# EAGLE schematic Draft Volt Meter Schematic (EAGLE 9.6.2)
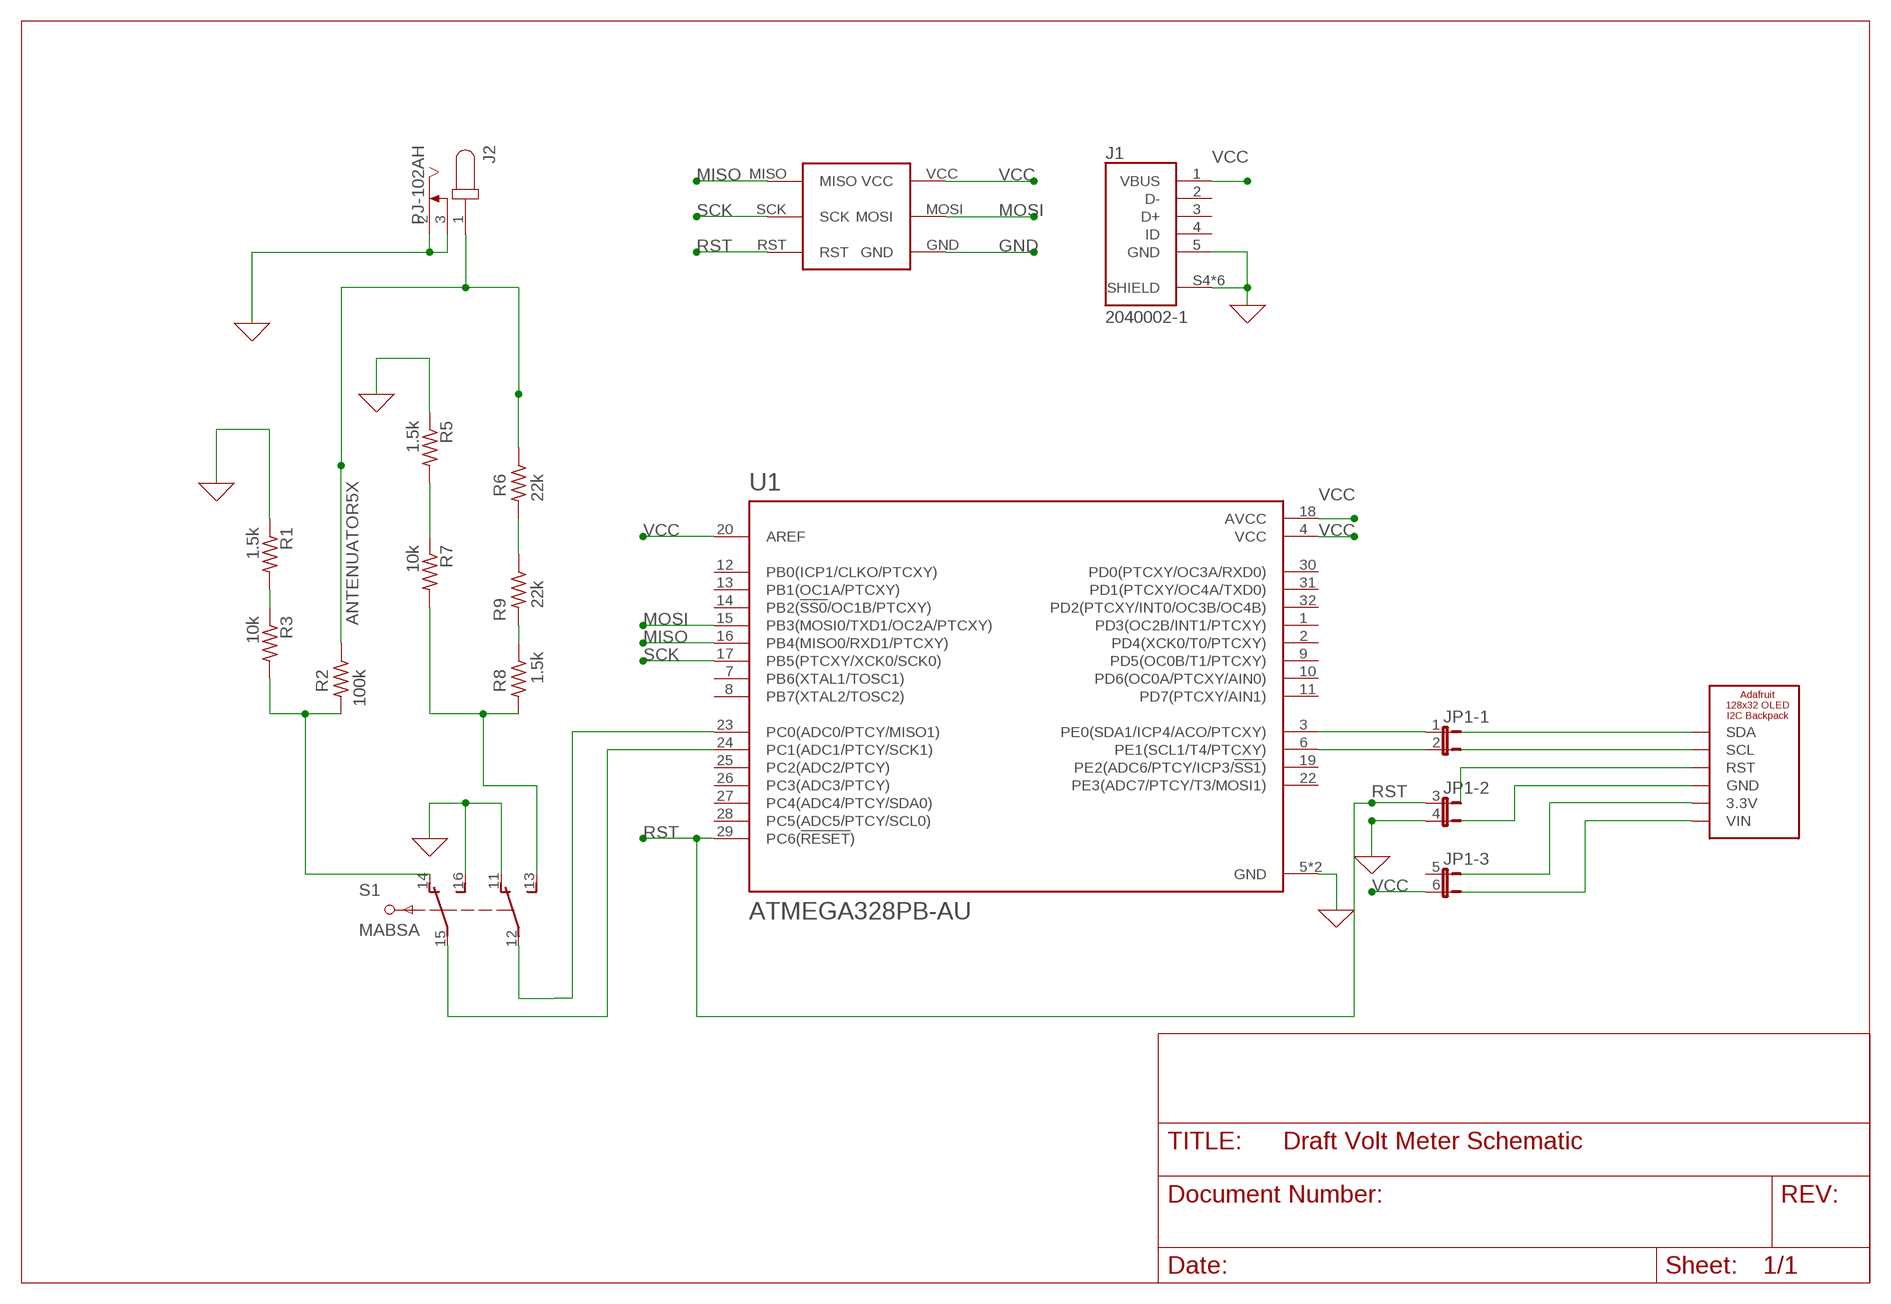
[diagram p0: schematic, sheet 1]

## Parts
J1  2040002-1  [TE_2040002-1]
J2  PJ-102AH  [CUI_PJ-102AH]
JP1  JP3QE  [JP3Q]
R1  1.5k  R-US_0411/15  [0411/15]
R2  100k  R-US_0411/15  [0411/15]
R3  10k  R-US_0411/15  [0411/15]
R5  1.5k  R-US_0411/15  [0411/15]
R6  22k  R-US_0411/15  [0411/15]
R7  10k  R-US_0411/15  [0411/15]
R8  1.5k  R-US_0411/15  [0411/15]
R9  22k  R-US_0411/15  [0411/15]
S1  MABSA  [MABSA]
U1  ATMEGA328PB-AU  [QFP80P900X900X120-32N]
U$1  AVR-ISP  [AVR-ISP]
U$3  ADAFRUIT_128X32_OLED  [ADAFRUIT_OLED_128X32]

## Nets
0: J1.5(GND) J1.S4(SHIELD) J1.S5(SHIELD) J1.SH1(SHIELD) J1.SH2(SHIELD) J1.SH3(SHIELD) J1.SH4(SHIELD) J2.2 J2.3 JP1.4 R1.1 R5.1 S1.11 S1.16 U1.5(GND) U1.21(GND) ; supply symbol labelled GND
ANTENUATOR5X: J2.1 R2.1 R6.1
GND: U$1.GND
MISO: U1.16(PB4(MISO0/RXD1/PTCXY)) U$1.MISO
MOSI: U1.15(PB3(MOSI0/TXD1/OC2A/PTCXY)) U$1.MOSI
N$1: U$3.P$1(SDA)
N$2: JP1.2 U1.6(PE1(SCL1/T4/PTCXY))
N$3: S1.15 U1.24(PC1(ADC1/PTCY/SCK1))
N$4: U$3.P$2(SCL)
N$5: U$3.P$5(3.3V)
N$6: JP1.1 U1.3(PE0(SDA1/ICP4/ACO/PTCXY))
N$8: U$3.P$4(GND)
N$9: R2.2 R3.2 S1.14
N$11: R7.2 R8.2 S1.13
N$12: R5.2 R7.1
N$13: R8.1 R9.2
N$14: R6.2 R9.1
N$15: R1.2 R3.1
N$16: S1.12 U1.23(PC0(ADC0/PTCY/MISO1))
RST: JP1.3 U1.29(PC6(!RESET!)) U$1.RST U$3.P$3(RST)
SCK: U1.17(PB5(PTCXY/XCK0/SCK0)) U$1.SCK
VCC: J1.1(VBUS) JP1.6 U1.4(VCC) U1.18(AVCC) U1.20(AREF) U$1.VCC U$3.P$6(VIN)
Unconnected: J1.2(D-) J1.3(D+) J1.4(ID) JP1.5 U1.1(PD3(OC2B/INT1/PTCXY)) U1.2(PD4(XCK0/T0/PTCXY)) U1.7(PB6(XTAL1/TOSC1)) U1.8(PB7(XTAL2/TOSC2)) U1.9(PD5(OC0B/T1/PTCXY)) U1.10(PD6(OC0A/PTCXY/AIN0)) U1.11(PD7(PTCXY/AIN1)) U1.12(PB0(ICP1/CLKO/PTCXY)) U1.13(PB1(OC1A/PTCXY)) U1.14(PB2(!SS0!/OC1B/PTCXY)) U1.19(PE2(ADC6/PTCY/ICP3/!SS1!)) U1.22(PE3(ADC7/PTCY/T3/MOSI1)) U1.25(PC2(ADC2/PTCY)) U1.26(PC3(ADC3/PTCY)) U1.27(PC4(ADC4/PTCY/SDA0)) U1.28(PC5(ADC5/PTCY/SCL0)) U1.30(PD0(PTCXY/OC3A/RXD0)) U1.31(PD1(PTCXY/OC4A/TXD0)) U1.32(PD2(PTCXY/INT0/OC3B/OC4B))

## Library data of the parts
J1 = 2040002-1:2040002-1: Conn USB Type B RCP 5 POS 0.65mm Solder RA SMD 5 Terminal 1 Port T/R Check prices <https://pricing.snapeda.com/search/part/2040002-1/?ref=eda>; AVAILABILITY: Good; CENTERLINE_PITCH: .65 mm[.025 in]; COMMENT: 2040002-1; DESCRIPTION: Conn Micro USB 2.0 Type B RCP 5 POS 0.65mm Solder RA SMD 5 Terminal 1 Port T/R; MF: TE Connectivity; MP: 2040002-1; NUMBER_OF_POSITIONS: 5; PACKAGE: None; PRICE: None; PRODUCT_TYPE: Connector; PURCHASE-URL: https://pricing.snapeda.com/search/part/2040002-1/?ref=eda
J2 = PJ-102AH:PJ-102AH: 2.0 mm Center Pin, 5.0 A, Right Angle, Through Hole, Tapered Pins, Dc Power Jack Connector Check prices <https://pricing.snapeda.com/parts/PJ-102AH/CUI%20Devices/view-part?ref=eda>; AVAILABILITY: Good; CUI_PURCHASE_URL: https://www.cuidevices.com/product/interconnect/connectors/dc-power-connectors/jacks/pj-102ah?utm_source=snapeda.com&utm_medium=referral&utm_campaign=snapedaBOM; DESCRIPTION: 2.0 x 6.5 mm, 5.0 A, Horizontal, Through Hole, Tapered Pins, Dc Power Jack Connector; MF: CUI Devices; MP: PJ-102AH; PACKAGE: None; PRICE: None; PURCHASE-URL: https://pricing.snapeda.com/search/part/PJ-102AH/?ref=eda
JP1 = jumper:JP3QE: JUMPER
R1-R3 R5-R9 = rcl:R-US_: RESISTOR, American symbol; SPICEPREFIX: R
S1 = con-hirschmann:MABSA: Dual SWITCH; OC_FARNELL: unknown; OC_NEWARK: unknown
U1 = ATMEGA328PB-AU:ATMEGA328PB-AU: ATmega Series 20 MHz 32 KB Flash 2 KB SRAM 8-Bit Microcontroller - TQFP-32; DESCRIPTION: AVR AVR® ATmega Microcontroller IC 8-Bit 20MHz 32KB (16K x 16) FLASH 32-TQFP (7x7); DIGI-KEY_PART_NUMBER: ATMEGA328PB-AURTR-ND; MF: Microchip Technology; MP: ATMEGA328PB-AU; PACKAGE: TQFP-32 Microchip Technology; PURCHASE-URL: https://pricing.snapeda.com/search/part/ATMEGA328PB-AU/?ref=eda
U$1 = AVR-ISP:AVR-ISP: Check prices <https://pricing.snapeda.com/search/part/AVR-ISP/?ref=eda>; AVAILABILITY: Bad; DESCRIPTION: Emulators / Simulators AVR USB IN CIRCUIT EMUL/PRGMR ISP; MF: Gravitech; MP: AVR-ISP; PACKAGE: None; PRICE: None
U$3 = OLED 128x32 I2c Display:ADAFRUIT_128X32_OLED: Adafriut 128x32 OLED display with I2C communication http://www.adafruit.com/products/931